# EAGLE board snc98_Display_15x7-Segment_LED (EAGLE 6.6.0)
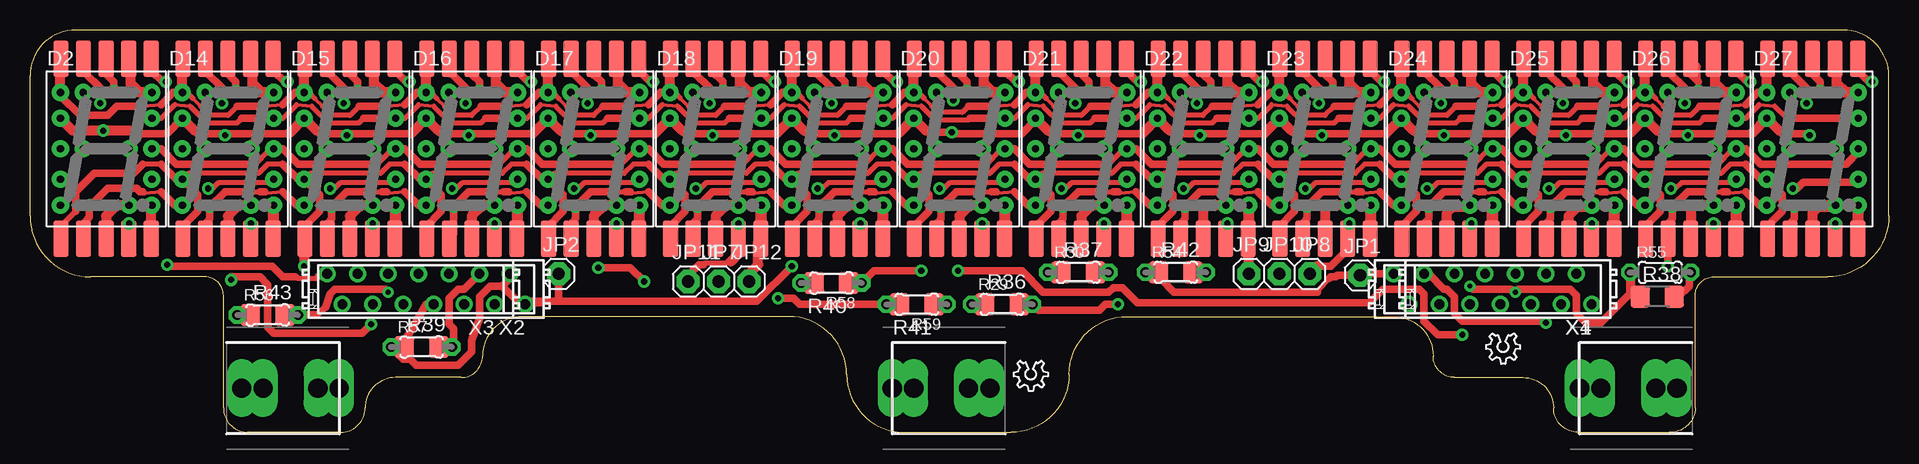
[diagram p2: board, top side]
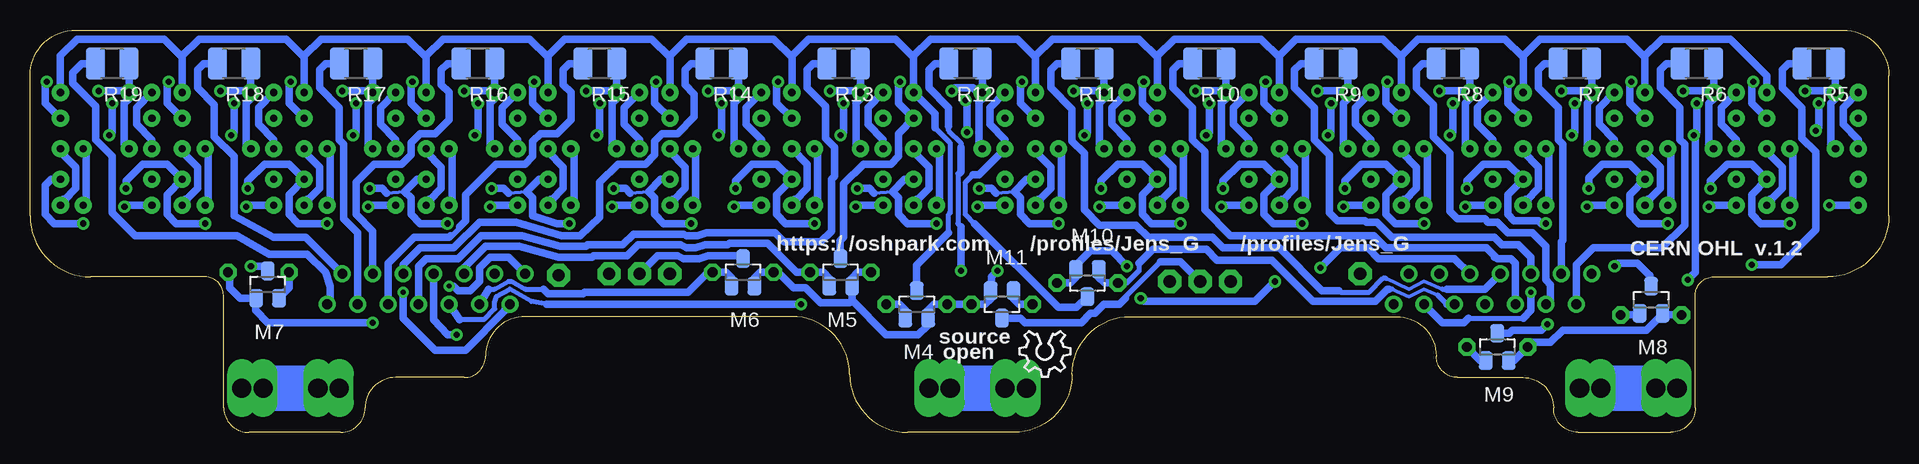
[diagram p3: board, bottom side, seen from below]

Size 154.94 x 33.53 mm. Coordinates in mm from the lower left corner, seen from the top.
Outline: 154.94,29.72 arc90 151.13,33.53 3.81,33.53 arc90 0,29.72 0,18.03 arc90 5.08,12.95 14.61,12.95 arc-90 16.13,11.43 16.13,2.03 arc90 18.16,0 25.91,0 arc90 27.94,2.03 arc-90 30.48,4.57 35.94,4.57 arc90 37.72,6.35 arc-90 41.02,9.65 63.25,9.65 arc-90 68.07,4.83 arc90 72.9,0 81.79,0 arc90 86.61,4.83 arc-90 91.44,9.65 113.67,9.65 arc-90 116.97,6.35 arc90 118.75,4.57 124.46,4.57 arc-90 127,2.03 arc90 129.03,0 136.65,0 arc90 138.81,2.03 138.81,11.43 arc-90 140.34,12.95 149.86,12.95 arc90 154.94,18.03 154.94,29.72
Copper layers (1*16): Top 0.035mm / dielectric 1.5mm / Bottom 0.035mm
Design rules "OSHPark-8mil-2layer": minimum track width 10mil, minimum drill 15mil, track to track 8mil, track to pad 8mil, pad to pad 8mil, via to via 8mil, smd to smd 8mil, copper to edge 8mil, drill to drill 8mil, minimum pad ring 12mil, minimum via ring 10mil, stop-mask expansion 4mil, vias tented up to drill 20mil, thermal gap 10mil

## Footprints (pad centres in the part's own frame; a part is rotated, then mirrored left to right if it is on the bottom)
BATTERY-AAA-LEFT = drill 1.6 long: P1 -2.54,0; P2 3.81,0; P3 2.032,0; P4 -4.318,0
BATTERY-AAA-RIGHT = drill 1.6 long: M1 -3.81,0; M2 2.54,0; M3 4.318,0; M4 -2.032,0
10MM_UNI = drill 0.6 pad 1.422: 1 -3.81,4.699; 2 -3.81,2.54; 3 -3.81,0; 4 -3.81,-2.54; 5 -3.81,-4.699; 6 3.81,-4.699; 7 3.81,-2.54; 8 3.81,0; 9 3.81,2.54; 10 3.81,4.699; 11 -1.905,4.699; 12 -1.905,0; 13 1.905,0; 14 1.905,-4.699 | smd 1.27 x 3.048: 21 -3.76,-7.5; 22 -1.88,-7.5; 23 0,-7.5; 24 1.88,-7.5; 25 3.76,-7.5; 26 3.76,7.5; 27 1.88,7.5; 28 0,7.5; 29 -1.88,7.5; 30 -3.76,7.5
1X01 = drill 1.016 pad 1.93 octagon: 1 0,0
SOT-23 = smd 1.143 x 1.524: 1 0.953,1.143; 2 -0.953,1.143; 3 0,-1.143
R1210 = smd 1.6 x 2.7: 1 -1.4,0; 2 1.4,0
0204/5 = drill 0.813 octagon: 1 -2.54,0; 2 2.54,0
R1206 = smd 1.6 x 1.803: 1 -1.422,0; 2 1.422,0
MICROMATCH-12 = drill 0.813: 1 6.985,-1.27; 2 5.715,1.27; 3 4.445,-1.27; 4 3.175,1.27; 5 1.905,-1.27; 6 0.635,1.27; 7 -0.635,-1.27; 8 -1.905,1.27; 9 -3.175,-1.27; 10 -4.445,1.27; 11 -5.715,-1.27; 12 -6.985,1.27
MICROMATCH-14 = drill 0.813: 1 8.255,-1.27; 2 6.985,1.27; 3 5.715,-1.27; 4 4.445,1.27; 5 3.175,-1.27; 6 1.905,1.27; 7 0.635,-1.27; 8 -0.635,1.27; 9 -1.905,-1.27; 10 -3.175,1.27; 11 -4.445,-1.27; 12 -5.715,1.27; 13 -6.985,-1.27; 14 -8.255,1.27

## Placement (x,y rotation side)
BH4  HOLDER_AAA_LEFT1  [BATTERY-AAA-LEFT]  133.48,3.68 0 top
BH5  HOLDER_AAA_LEFT1  [BATTERY-AAA-LEFT]  76.2,3.68 0 top
BH6  HOLDER_AAA_RIGHT  [BATTERY-AAA-RIGHT]  21.46,3.68 0 top
D2  SC40-11_UNISC40-11_UNI  [10MM_UNI]  6.35,23.62 0 top
D14  SC40-11_UNISC40-11_UNI  [10MM_UNI]  16.51,23.62 0 top
D15  SC40-11_UNISC40-11_UNI  [10MM_UNI]  26.67,23.62 0 top
D16  SC40-11_UNISC40-11_UNI  [10MM_UNI]  36.83,23.62 0 top
D17  SC40-11_UNISC40-11_UNI  [10MM_UNI]  46.99,23.62 0 top
D18  SC40-11_UNISC40-11_UNI  [10MM_UNI]  57.15,23.62 0 top
D19  SC40-11_UNISC40-11_UNI  [10MM_UNI]  67.31,23.62 0 top
D20  SC40-11_UNISC40-11_UNI  [10MM_UNI]  77.47,23.62 0 top
D21  SC40-11_UNISC40-11_UNI  [10MM_UNI]  87.63,23.62 0 top
D22  SC40-11_UNISC40-11_UNI  [10MM_UNI]  97.79,23.62 0 top
D23  SC40-11_UNISC40-11_UNI  [10MM_UNI]  107.95,23.62 0 top
D24  SC40-11_UNISC40-11_UNI  [10MM_UNI]  118.11,23.62 0 top
D25  SC40-11_UNISC40-11_UNI  [10MM_UNI]  128.27,23.62 0 top
D26  SC40-11_UNISC40-11_UNI  [10MM_UNI]  138.43,23.62 0 top
D27  SC40-11_UNISC40-11_UNI  [10MM_UNI]  148.59,23.62 0 top
JP1  [1X01]  110.87,13.08 0 top
JP2  [1X01]  44.07,13.21 0 top
JP7  [1X01]  57.4,12.57 0 top
JP8  [1X01]  106.68,13.21 0 top
JP9  [1X01]  101.6,13.21 0 top
JP10  [1X01]  104.14,13.21 0 top
JP11  [1X01]  54.86,12.57 0 top
JP12  [1X01]  59.94,12.57 0 top
LOGO1  OSHW_LOGO_8MILX0150-NT  [OSHW_8X150_NOTEXT]  68.22,8.43 180 bottom
LOGO2  OSHW_LOGO_6MILX0100-NT  [OSHW_6X100_NOTEXT]  84.84,5.97 180 top
LOGO3  OSHW_LOGO_6MILX0100-NT  [OSHW_6X100_NOTEXT]  124.21,8.26 180 top
M4  IRLML2244  [SOT-23]  81.03,10.67 180 bottom
M5  IRLML2244  [SOT-23]  87.38,13.34 180 bottom
M6  IRLML2244  [SOT-23]  95.5,13.34 180 bottom
M7  IRLML2244  [SOT-23]  135.13,12.32 180 bottom
M8  IRLML2244  [SOT-23]  19.81,11.05 180 bottom
M9  IRLML2244  [SOT-23]  32.64,7.11 180 bottom
M10  IRLML2244  [SOT-23]  66.8,12.45 0 bottom
M11  IRLML2244  [SOT-23]  73.91,10.67 0 bottom
R5  22  [R1210]  5.84,30.73 180 bottom
R6  22  [R1210]  16,30.73 180 bottom
R7  22  [R1210]  26.16,30.73 180 bottom
R8  22  [R1210]  36.32,30.73 180 bottom
R9  22  [R1210]  46.48,30.73 180 bottom
R10  22  [R1210]  56.64,30.73 180 bottom
R11  22  [R1210]  66.8,30.73 180 bottom
R12  22  [R1210]  76.96,30.73 180 bottom
R13  22  [R1210]  87.12,30.73 180 bottom
R14  22  [R1210]  97.28,30.73 180 bottom
R15  22  [R1210]  107.44,30.73 180 bottom
R16  22  [R1210]  117.6,30.73 180 bottom
R17  22  [R1210]  127.76,30.73 180 bottom
R18  22  [R1210]  137.92,30.73 180 bottom
R19  22  [R1210]  148.08,30.73 180 bottom
R29  3k3  [0204/5]  81.03,10.67 0 top
R30  3k3  [0204/5]  87.38,13.34 0 top
R36  3k3  [R1206]  81.03,10.67 0 top
R37  3k3  [R1206]  87.38,13.34 0 top
R38  3k3  [R1206]  135.64,11.3 0 top
R39  3k3  [R1206]  32.64,7.11 0 top
R40  3k3  [R1206]  66.8,12.45 180 top
R41  3k3  [R1206]  73.91,10.67 180 top
R42  3k3  [R1206]  95.5,13.34 0 top
R43  3k3  [R1206]  19.81,9.78 0 top
R54  3k3  [0204/5]  95.5,13.34 0 top
R55  3k3  [0204/5]  135.89,13.34 0 top
R56  3k3  [0204/5]  19.81,9.78 0 top
R57  3k3  [0204/5]  32.64,7.11 0 top
R58  3k3  [0204/5]  66.8,12.45 180 top
R59  3k3  [0204/5]  73.91,10.67 180 top
X1  MICROMATCH-12  [MICROMATCH-12]  123.19,11.94 180 top
X2  MICROMATCH-14  [MICROMATCH-14]  33.02,11.94 180 top
X3  MICROMATCH-12  [MICROMATCH-12]  31.75,11.94 180 top
X4  MICROMATCH-14  [MICROMATCH-14]  121.92,11.94 180 top

## Tracks (layer width: path | path; a pad name or v marks a point on that pad's centre or on a via)
CA_LED  (via drill 0.41, 0.51)
  Top 0.254: 31.92,8.79 31.75,8.89 31.75,7.62 R39.1
  Top 0.406: 36.2,6.22 36.2,6.1 | 108.33,12.83 107.31,11.81 107.31,11.68
  Top 0.61: R43.1 R56.1 | 43.81,10.92 60.58,10.92 v63.5,13.84 | 43.81,10.92 42.67,10.92 | 42.67,10.92 40.64,10.92 39.37,12.19 | R36.1 R29.1 | R37.1 85.95,13.36 85.85,13.46 84.96,13.46 R30.1 | R54.1 93.7,13.31 R42.1 94.25,13.17 94.25,12.79 95.36,11.68 107.31,11.68 | X2.8 33.02,10.67 31.92,8.79 31.24,7.62 31.24,7.14 | 39.37,12.19 38.35,12.19 37.47,11.3 37.47,9.53 36.83,7.62 36.83,6.73 36.2,6.1 35.69,5.59 32.21,5.59 31.7,6.1 31.11,6.1 R57.1 R39.1 | X4.1 110.24,13.21 JP1.1 108.97,13.08 108.84,12.95 108.46,12.95 108.33,12.83 | X2.13 40.01,12.83 39.37,12.19 | X2.14 42.55,10.79 42.67,10.92 | JP2.1 44.07,11.18 43.81,10.92 | R58.1 R40.1 | R58.1 68.76,12.45 | 31.7,6.63 R39.1 | 31.11,7.21 R39.1 | R41.1 R59.1 | v74.3,13.46 70.36,13.46 R58.1 | R38.1 134.21,11.33 133.48,12.06 133.48,13.21 R55.1 133.35,11.56 130.94,9.14 129.67,9.14 128.91,9.91 128.91,11.43 128.4,11.94 124.08,11.94 v123.83,11.68 123.7,11.68 123.44,11.94 120.27,11.94 v120.02,12.19
  Bottom 0.61: v63.5,13.84 64.77,15.11 66.55,15.11 67.74,13.92 M10.2 67.74,12.93 R40.1 R58.1 68.33,12.45 | R56.1 18.75,9.78 M8.2 19,9.7 20.19,8.51 27.18,8.51 28.19,7.49 29.72,7.49 R57.1 31.24,5.97 M9.2 | R30.1 R37.1 86.44,12.85 M5.2 86.44,12.31 86.44,11 | 86.44,11 83.57,8.13 80.9,8.13 80.14,8.89 80.14,9.6 M4.2 80.09,10.19 R36.1 R29.1 R59.1 R41.1 74.85,11.15 M11.2 74.8,11.73 74.8,12.95 v74.3,13.46 | 86.44,11 86.64,10.79 89.03,10.79 90.3,12.06 91.31,12.06 92.58,13.34 R54.1 R42.1 94.55,12.87 M6.2 | v120.02,12.19 119.63,12.19 119.25,11.81 118.24,11.81 117.47,12.57 117.47,13.72 116.59,14.61 115.06,14.61 X4.1 | v123.83,11.68 123.83,9.53 121.16,6.86 118.62,6.86 115.32,10.16 115.32,10.29 X4.2 | M7.2 R38.1 134.21,11.33 133.6,11.81 | 133.6,11.81 133.35,12.06 R55.1 | 133.6,11.81 134.11,11.3 134.24,11.3
D0_A  (via drill 0.51)
  Top 0.406: 22.1,12.95 22.23,12.95 22.35,12.83 23.88,12.83 24,12.95
  Top 0.61: v11.43,13.97 11.56,13.84 20.19,13.84 21.08,12.95 22.1,12.95 | X2.1 24.26,13.21 24,12.95
  Bottom 0.61: v11.43,13.97 9.02,13.97 6.1,16.89 6.1,23.37 7.24,24.51 7.24,27.05 8.89,28.7 8.89,30.23 8.38,30.73 R5.2
D1_A
  Bottom 0.61: R6.2 18.54,30.73 19.05,30.23 19.05,28.7 17.4,27.05 17.4,24.38 17.02,24 17.02,17.27 18.92,15.37 24.64,15.37 26.04,13.97 X2.2
D2_A
  Bottom 0.61: X3.3 27.3,15.88 27.18,16 27.18,24 27.56,24.38 27.56,27.05 29.21,28.7 29.21,30.23 28.7,30.73 R7.2
D3_A
  Bottom 0.61: R8.2 38.86,30.73 39.37,30.23 39.37,28.7 37.97,27.3 37.97,24.64 36.58,23.24 36.58,18.41 35.94,17.78 33.66,17.78 33.4,17.53 32.64,17.53 31.75,16.64 29.72,16.64 28.57,15.49 28.57,12.7 28.19,12.32 28.19,11.05 X3.4
D4_A
  Bottom 0.61: R9.2 49.02,30.73 49.53,30.23 49.53,28.7 47.88,27.05 47.88,24.38 46.61,23.11 46.61,18.29 45.97,17.65 43.69,17.65 43.56,17.53 42.67,17.53 41.4,16.26 32.89,16.26 32.26,15.62 30.86,15.62 29.84,14.61 X3.5
D5_A
  Bottom 0.61: R10.2 59.18,30.73 59.69,30.23 59.69,28.7 58.04,27.05 58.04,24.38 57.02,23.37 57.02,18.54 54.86,16.38 42.93,16.38 41.91,15.37 33.53,15.37 32.77,14.61 | 32.89,14.61 32.77,14.61 | X3.6 31.11,14.1 31.5,14.48 32.64,14.48 32.77,14.61
D6_A
  Bottom 0.305: 37.21,11.94 38.73,12.57 40.01,11.94 41.91,12.83
  Bottom 0.406: 37.21,11.94 36.83,11.94 | 41.91,12.83 42.16,12.83 43.31,11.68 45.72,11.68 45.85,11.81
  Bottom 0.61: 45.85,11.81 47.24,11.81 50.8,15.37 55.5,15.37 56.39,16.26 61.72,16.26 62.74,17.27 65.79,17.27 67.06,18.54 67.06,23.24 68.07,24.26 68.07,26.92 69.85,28.7 69.85,30.23 69.34,30.73 R11.2 | X3.7 33.66,11.94 36.83,11.94
D7_A  (via drill 0.51)
  Top 0.61: v77.34,13.46 82.68,13.46 84.45,11.68 89.92,11.68 90.3,12.06 91.06,12.06 92.33,10.79 111.63,10.79 112.78,11.94 115.82,11.94 116.2,11.56 116.2,9.27 117.35,8.13 v119.38,8.13
  Bottom 0.406: 77.34,21.72 77.34,21.59 77.47,21.46 77.6,21.59 77.6,17.4 77.34,17.14 | 77.34,23.75 77.34,24.13 78.36,25.15 78.36,25.52
  Bottom 0.61: 77.34,17.14 v77.34,13.46 | R12.2 79.5,30.73 80.01,30.23 80.01,28.7 78.36,27.05 78.36,25.53 78.36,25.52 | 77.34,21.72 77.34,23.75 | X4.7 121.28,9.4 120.14,8.13 v119.38,8.13
D8_A
  Bottom 0.61: X4.8 122.56,13.84 121.92,14.48 119.25,14.48 117.35,16.38 113.92,16.38 110.74,15.49 108.58,15.49 108.46,15.62 105.54,15.62 104.65,16.51 100.46,16.51 100.2,16.38 99.31,16.38 98.55,16.64 92.84,16.64 92.08,15.88 89.03,15.88 88.14,16.76 88.14,21.08 87.88,21.34 87.88,23.75 88.65,24.51 88.65,27.18 90.17,28.7 90.17,30.23 89.66,30.73 R13.2
D9_A
  Bottom 0.61: X4.9 123.83,13.97 122.43,15.37 119.63,15.37 117.47,17.53 114.43,17.53 110.62,16.38 109.09,16.38 107.44,17.91 107.44,20.83 105.92,22.35 103.63,22.35 102.87,23.11 102.87,24.26 102.23,24.89 100.97,24.89 99.57,26.29 99.57,28.19 100.33,28.96 100.33,30.23 99.82,30.73 R14.2
D10_A
  Bottom 0.406: 119.89,16.38 119.76,16.38 119.13,17.02 119.13,17.14
  Bottom 0.61: 119.89,16.38 120.02,16.26 122.94,16.26 125.09,14.1 X4.10 | 119.13,17.14 118.62,17.65 118.62,19.81 116.08,22.35 113.67,22.35 113.03,22.99 113.03,24.26 112.39,24.89 111,24.89 109.86,26.04 109.86,28.32 110.49,28.96 110.49,30.23 109.98,30.73 R15.2
D11_A
  Bottom 0.61: R16.2 120.14,30.73 120.65,30.23 120.65,28.96 120.02,28.32 120.02,26.04 121.16,24.89 122.43,24.89 123.19,24.13 123.19,23.11 123.95,22.35 126.24,22.35 127.76,20.83 127.76,18.16 126.36,16.76 X1.9
D12_A
  Bottom 0.61: 129.29,30.61 R17.2 130.3,30.73 130.81,30.23 130.81,28.7 129.16,27.05 129.16,24.38 128.78,24 128.78,17.78 127.64,16.64 X4.12
D13_A
  Bottom 0.61: X4.13 131.95,16.26 134.62,16.26 137.92,18.03 137.92,22.99 139.57,24.64 139.57,27.3 140.97,28.7 140.97,30.23 140.46,30.73 R18.2
D14_A
  Bottom 0.61: 149.73,30.48 R19.2 150.62,30.73 151.38,29.97 151.38,29.08 149.48,27.18 149.48,24.38 148.08,22.99 148.08,18.29 146.18,16.38 137.67,16.38 135,14.86 131.83,14.86 130.3,13.34 129.92,12.19 129.92,10.92 X4.14
DIG_0  (via drill 0.51)
  Top 0.61: D2.28 6.35,29.84 6.99,29.21 v6.99,28.45
  Top 0.813: D2.14 7.24,18.92 6.35,18.03 D2.23 | D2.13 D2.12
  Bottom 0.61: D2.12 4.83,24 4.83,27.43 4.45,27.81 D2.11 4.45,30.48 4.44,30.48 R5.1 | v6.99,28.45 4.7,28.45 4.45,28.7 | 8.26,23.5 8,23.24 8,19.18 D2.14
  Bottom 0.813: D2.11 4.45,28.7 | D2.13 8.26,23.5
DIG_1  (via drill 0.51)
  Top 0.406: 16.13,29.84 16.51,29.84 D14.28
  Top 0.61: 16.51,29.84 17.14,29.21 v17.14,28.45
  Top 0.813: D14.23 16.51,18.03 17.4,18.92 D14.14 | D14.13 D14.12
  Bottom 0.305: R6.1 14.6,30.48 14.61,30.48
  Bottom 0.61: D14.12 14.99,24 14.99,27.43 14.61,27.81 D14.11 14.61,30.48 | 14.61,28.7 14.86,28.45 v17.14,28.45 | 18.41,23.5 18.16,23.24 18.16,19.18 D14.14
  Bottom 0.813: D14.11 14.61,28.7 | D14.13 18.41,23.5
DIG_2  (via drill 0.51)
  Top 0.61: v27.3,28.45 27.3,29.21 26.67,29.84 D15.28
  Top 0.813: D15.13 D15.12 | D15.23 26.67,18.03 27.56,18.92 D15.14
  Bottom 0.305: R7.1 24.76,30.48 24.77,30.48
  Bottom 0.61: D15.12 25.15,24 25.15,27.43 24.77,27.81 D15.11 24.77,30.48 | 24.77,28.7 25.02,28.45 v27.3,28.45 | 28.57,23.5 28.32,23.24 28.32,19.18 D15.14
  Bottom 0.813: D15.11 24.77,28.7 | D15.13 28.57,23.5
DIG_3  (via drill 0.51)
  Top 0.61: v37.47,28.45 37.47,29.21 36.83,29.84 D16.28
  Top 0.813: D16.13 D16.12 | D16.23 36.83,18.03 37.72,18.92 D16.14
  Bottom 0.61: 38.73,23.5 38.48,23.24 38.48,19.18 D16.14 | D16.12 35.31,24 35.31,27.43 34.92,27.81 D16.11 R8.1 | 34.92,28.7 35.18,28.45 v37.47,28.45
  Bottom 0.813: D16.13 38.73,23.5 | D16.11 34.92,28.7
DIG_4  (via drill 0.51)
  Top 0.61: 46.99,29.84 47.62,29.21 v47.62,28.45
  Top 0.813: D17.23 46.99,18.03 47.88,18.92 D17.14 | D17.13 D17.12 | 46.99,29.84 D17.28
  Bottom 0.61: D17.12 45.47,24 45.47,27.43 45.09,27.81 D17.11 45.09,30.48 | 45.09,28.7 45.34,28.45 v47.62,28.45 | 48.9,23.5 48.64,23.24 48.64,19.18 D17.14
  Bottom 0.813: D17.11 45.09,28.7 | D17.13 48.9,23.5 | 45.09,30.48 R9.1
DIG_5  (via drill 0.51)
  Top 0.61: 57.15,29.84 57.78,29.21 v57.78,28.45
  Top 0.813: D18.12 D18.13 | D18.23 57.15,18.03 58.04,18.92 D18.14 | D18.28 57.15,29.84
  Bottom 0.61: 59.05,23.5 58.8,23.24 58.8,19.18 D18.14 | D18.12 55.63,24 55.63,27.43 55.24,27.81 D18.11 55.24,30.48 | 55.24,28.7 55.5,28.45 v57.78,28.45
  Bottom 0.813: D18.13 59.05,23.5 | D18.11 55.24,28.7 | 55.24,30.48 R10.1
DIG_6  (via drill 0.51)
  Top 0.61: v67.94,28.45 67.94,29.21 67.31,29.84 D19.28
  Top 0.813: D19.13 D19.12 | D19.23 67.31,18.03 68.2,18.92 D19.14
  Bottom 0.61: D19.12 65.79,24 65.79,27.43 65.41,27.81 D19.11 R11.1 | v67.94,28.45 65.66,28.45 65.41,28.7 | 69.22,23.5 68.96,23.24 68.96,19.18 D19.14
  Bottom 0.813: D19.11 65.41,28.7 | D19.13 69.22,23.5
DIG_7  (via drill 0.51)
  Top 0.61: v78.11,28.45 78.11,29.21 77.47,29.84 D20.28
  Top 0.813: D20.13 D20.12 | D20.23 77.47,18.03 78.36,18.92 D20.14
  Bottom 0.61: D20.12 75.82,23.88 75.82,27.56 75.56,27.81 D20.11 R12.1 | 75.56,28.7 75.82,28.45 76.07,28.45 76.33,28.7 77.85,28.7 v78.11,28.45 | 79.38,23.5 79.12,23.24 79.12,19.18 D20.14
  Bottom 0.813: D20.11 75.56,28.7 | D20.13 79.38,23.5
DIG_8  (via drill 0.51)
  Top 0.61: v88.27,28.45 88.27,29.21 87.63,29.84 D21.28
  Top 0.813: D21.13 D21.12 | D21.23 87.63,18.03 88.52,18.92 D21.14
  Bottom 0.61: D21.12 86.11,24 86.11,27.43 85.72,27.81 D21.11 R13.1 | v88.27,28.45 85.98,28.45 85.72,28.7 | 89.53,23.5 89.28,23.24 89.28,19.18 D21.14
  Bottom 0.813: D21.11 85.72,28.7 | D21.13 89.53,23.5
DIG_9  (via drill 0.51)
  Top 0.61: v98.42,28.45 98.42,29.21 97.79,29.84 D22.28
  Top 0.813: D22.23 97.79,18.54 98.17,18.92 D22.14 98.68,18.92 | D22.13 D22.12
  Bottom 0.61: D22.12 96.27,24 96.27,27.43 95.89,27.81 D22.11 95.89,30.48 | v98.42,28.45 96.14,28.45 95.89,28.7 | 99.69,23.5 99.44,23.24 99.44,19.18 D22.14
  Bottom 0.813: D22.11 95.89,28.7 | 95.89,30.48 R14.1 | D22.13 99.69,23.5
DIG_10  (via drill 0.51)
  Top 0.61: v108.58,28.45 108.58,29.21 107.95,29.84 D23.28
  Top 0.813: D23.13 D23.12 | D23.23 107.95,18.54 108.33,18.92 D23.14 108.84,18.92
  Bottom 0.61: 109.86,23.5 109.6,23.24 109.6,19.18 D23.14 | D23.12 106.43,24 106.43,27.43 106.05,27.81 D23.11 R15.1 | v108.58,28.45 106.3,28.45 106.05,28.7
  Bottom 0.813: D23.13 109.86,23.5 | D23.11 106.05,28.7
DIG_11  (via drill 0.51)
  Top 0.61: v118.75,28.45 118.75,29.21 118.11,29.84 D24.28
  Top 0.813: D24.13 D24.12 | D24.23 118.11,18.29 118.62,18.8 119.89,18.8 D24.14
  Bottom 0.61: D24.12 116.59,24 116.59,27.43 116.2,27.81 D24.11 R16.1 | 116.2,28.7 116.46,28.45 v118.75,28.45 | 120.02,23.5 119.76,23.24 119.76,19.18 D24.14
  Bottom 0.813: D24.11 116.2,28.7 | D24.13 120.02,23.5
DIG_12  (via drill 0.51)
  Top 0.406: 128.27,29.84 D25.28
  Top 0.61: 128.27,29.84 128.91,29.21 v128.91,28.45
  Top 0.813: D25.13 D25.12 | D25.23 128.27,18.03 129.03,18.8 130.05,18.8 D25.14
  Bottom 0.61: 130.18,23.5 129.92,23.24 129.92,19.18 D25.14 | D25.12 126.75,24 126.75,27.43 126.36,27.81 D25.11 R17.1 | v128.91,28.45 126.62,28.45 126.36,28.7
  Bottom 0.813: D25.13 130.18,23.5 | D25.11 126.36,28.7
DIG_13  (via drill 0.51)
  Top 0.406: v139.06,28.45 139.06,30.49 D26.28
  Top 0.61: 139.06,29.21 138.43,29.84 D26.28
  Top 0.813: D26.13 D26.12 | D26.14 138.81,18.92 138.43,18.54 D26.23
  Bottom 0.61: D26.12 136.91,24 136.91,27.43 136.53,27.81 D26.11 R18.1 | v139.06,28.45 136.78,28.45 136.53,28.7 | 140.34,23.5 140.08,23.24 140.08,19.18 D26.14
  Bottom 0.813: D26.11 136.53,28.7 | D26.13 140.34,23.5
DIG_14  (via drill 0.51)
  Top 0.61: v149.22,28.45 149.22,29.21 148.59,29.84 D27.28
  Top 0.813: D27.13 D27.12 | D27.23 148.59,18.29 149.1,18.8 150.37,18.8 D27.14 149.48,18.92
  Bottom 0.61: D27.12 147.07,24 147.07,27.43 146.69,27.81 D27.11 R19.1 | v149.22,28.45 146.94,28.45 146.69,28.7 | 150.5,23.5 150.24,23.24 150.24,19.18 D27.14
  Bottom 0.813: D27.11 146.69,28.7 | D27.13 150.5,23.5
IO-A  (via drill 0.51)
  Top 0.61: R36.2 R29.2 84.07,10.16 89.15,10.16 89.66,10.67 v90.68,10.67
  Bottom 0.406: 111.89,10.67 113.16,10.92 114.94,11.94 116.08,11.3 116.2,10.92 116.2,10.29 117.09,9.4 119.13,9.4
  Bottom 0.61: M4.1 81.97,10.19 R36.2 R29.2 | v90.68,10.67 111.89,10.67 | 119.13,9.4 X4.6
IO-B
  Top 0.61: R37.2 R30.2
  Bottom 0.61: M5.1 88.32,12.85 R37.2 R30.2 91.06,13.34 93.47,15.75 96.65,15.75 96.77,15.62 98.68,15.62 99.44,15.37 100.2,15.37 100.71,15.62 104.27,15.62 105.16,14.73 107.95,14.73 108.08,14.61 110.87,14.61 114.17,15.49 116.97,15.49 118.75,13.72 X4.5
IO-C
  Top 0.61: R42.2 97.56,13.31 R54.2
  Bottom 0.406: 116.71,11.94 116.2,11.94 115.06,12.57 114.81,12.57 113.67,11.94 112.14,11.94
  Bottom 0.61: 112.14,11.94 111.76,11.56 108.84,11.56 108.71,11.68 100.08,11.68 98.57,13.19 98.06,13.31 98.15,13.31 R54.2 R42.2 96.46,12.87 M6.1 | 116.71,11.94 X4.4
IO-D  (via drill 0.51 pad 0.25)
  Top 0.61: X4.3 116.59,13.21 117.86,11.94 118.11,11.94 118.75,11.3 118.75,9.91 119.38,9.27 126.24,9.27 v126.36,9.14 | R38.2 137.41,11.3 138.3,12.19 138.3,13.21 R55.2
  Bottom 0.61: v126.36,9.14 135.13,9.14 136.14,10.16 136.14,11.1 136.19,11.3 M7.1 137.41,11.18 138.3,12.06 138.3,13.21 R55.2
IO-DP  (via drill 0.51, 0.51 pad 0.25)
  Top 0.61: R41.2 R59.2 64.14,10.67 63.63,11.18 v62.36,11.18 | v47.37,13.72 50.04,13.72 v51.18,12.57
  Bottom 0.61: 71.83,10.67 R59.2 R41.2 72.96,11.14 M11.1 | v62.36,11.18 62.1,10.92 52.83,10.92 v51.18,12.57 | X3.9 36.2,14.48 42.55,14.48 43.43,15.37 45.72,15.37 v47.37,13.72
IO-E  (via drill 0.4)
  Top 0.406: 24.89,11.3 25.02,11.56
  Top 0.61: R43.2 R56.2 23.88,9.78 24.64,10.41 25.02,11.56 25.4,11.94 29.59,11.94 v29.84,11.68
  Bottom 0.406: 35.05,9.53 30.48,9.53
  Bottom 0.61: R56.2 20.88,9.78 M8.1 | v29.84,11.68 29.84,10.16 30.48,9.53 | X2.12 37.21,9.14 35.43,9.14 35.05,9.53
IO-F
  Top 0.61: R39.2 R57.2 35.31,7.24 35.31,8.64 34.92,9.02 34.92,11.18 35.69,11.94 36.2,11.94 X2.11
  Bottom 0.61: M9.1 34.04,5.97 R57.2
IO-G
  Top 0.61: R40.2 R58.2
  Bottom 0.305: 37.59,11.43 38.73,11.94 40.01,11.3 41.4,11.94
  Bottom 0.406: R58.2 63.5,12.45 62.48,13.46 62.48,14.1 | 36.83,10.67 37.59,11.43 | 41.4,11.94 41.66,11.94
  Bottom 0.61: 62.48,14.1 61.34,15.24 56.9,15.24 56.01,14.35 51.44,14.35 48.01,10.92 42.8,10.92 41.78,11.94 41.66,11.94 | M10.1 65.86,12.93 R40.2 R58.2 | X2.10 36.83,10.67
NC1
  Bottom 2.184: BH4.P1 BH4.P4 | BH4.P3 BH4.P2
  Bottom 3.81: BH4.P1 BH4.P3
NC2
  Bottom 2.184: BH5.P1 BH5.P4 | BH5.P3 BH5.P2
  Bottom 3.81: BH5.P1 BH5.P3
NC3
  Bottom 2.184: BH6.M1 BH6.M4 | BH6.M2 BH6.M3
  Bottom 3.81: BH6.M4 BH6.M2
SEG_A
  Top 0.61: 49.02,30.97 D17.27 | 59.18,30.97 D18.27 | 69.34,30.97 D19.27 | 130.3,30.97 D25.27 | 140.46,30.97 D26.27 | D27.27 150.62,30.97 | 109.98,30.97 D23.27 | 99.82,30.97 D22.27 | D16.27 38.86,30.97 | D24.27 120.14,30.97
  Top 0.813: D2.10 9.14,28.32 8.38,29.08 8.38,30.97 D2.27 | 18.54,29.08 19.3,28.32 D14.10 19.05,28.32 18.54,28.83 18.54,30.97 D14.27 | 150.62,29.08 151.38,28.32 D27.10 151.13,28.32 150.62,28.83 150.62,30.97 | 49.02,30.97 49.02,28.83 49.53,28.32 D17.10 49.78,28.32 49.02,29.08 | 29.46,28.32 29.21,28.32 28.7,28.83 28.7,30.97 D15.27 | 29.46,28.32 28.7,29.08 | D15.10 29.46,28.32 | 130.3,29.08 131.06,28.32 D25.10 130.81,28.32 130.3,28.83 130.3,30.97 | 140.46,29.08 141.22,28.32 D26.10 140.97,28.32 140.46,28.83 140.46,30.97 | 120.14,29.08 120.9,28.32 D24.10 120.65,28.32 120.14,28.83 120.14,30.97 | 99.82,29.08 100.58,28.32 D22.10 100.33,28.32 99.82,28.83 99.82,30.97 | 109.98,29.08 110.74,28.32 D23.10 110.49,28.32 109.98,28.83 109.98,30.97 | 79.5,29.08 80.26,28.32 D20.10 80.01,28.32 79.5,28.83 79.5,30.97 D20.27 | 89.66,29.08 90.42,28.32 D21.10 90.17,28.32 89.66,28.83 89.66,30.97 D21.27 | 59.18,29.08 59.94,28.32 D18.10 59.69,28.32 59.18,28.83 59.18,30.97 | 69.34,29.08 70.1,28.32 D19.10 69.85,28.32 69.34,28.83 69.34,30.97 | 38.86,29.08 39.62,28.32 D16.10 39.37,28.32 38.86,28.83 38.86,30.97
  Bottom 0.406: 78.36,16.64 78.36,18.16 78.23,18.29 78.23,24.13 79.5,25.4
  Bottom 0.61: D2.10 10.16,29.72 13.21,32.77 18.92,32.77 20.32,31.37 20.32,31.24 | D14.10 20.32,31.24 | 20.32,31.24 21.84,32.77 29.08,32.77 30.48,31.37 30.48,31.24 | D27.10 152.4,31.37 151,32.77 143.76,32.77 142.24,31.24 | 142.24,31.24 142.24,31.37 140.84,32.77 133.6,32.77 132.08,31.24 | D26.10 142.24,31.24 | 121.92,31.24 121.92,31.37 120.52,32.77 113.28,32.77 111.76,31.24 | D24.10 121.92,31.24 | 121.92,31.24 123.44,32.77 130.68,32.77 132.08,31.37 132.08,31.24 | 111.76,31.24 111.76,31.37 110.36,32.77 103.12,32.77 101.6,31.24 | D23.10 111.76,31.24 | 101.6,31.24 101.6,31.37 100.2,32.77 92.96,32.77 91.44,31.24 | D22.10 101.6,31.24 | 91.44,31.24 91.44,31.37 90.04,32.77 82.8,32.77 81.28,31.24 | D21.10 91.44,31.24 | 71.12,31.24 71.12,31.37 69.72,32.77 62.48,32.77 60.96,31.24 | D19.10 71.12,31.24 | 71.12,31.24 72.64,32.77 79.88,32.77 81.28,31.37 81.28,31.24 | 60.96,31.24 60.96,31.37 59.56,32.77 52.32,32.77 50.8,31.24 | D18.10 60.96,31.24 | 50.8,31.24 50.8,31.37 49.4,32.77 42.16,32.77 40.64,31.24 | D17.10 50.8,31.24 | 40.64,31.24 40.64,31.37 39.24,32.77 32,32.77 30.48,31.24 | D16.10 40.64,31.24 | D15.10 30.48,31.24 | D25.10 132.08,31.24 | 81.28,31.24 D20.10 79.5,26.54 79.5,25.4 | 78.36,16.64 81.05,13.95 81.05,11.71 M4.3
SEG_B  (via drill 0.51)
  Top 0.305: 12.06,27.3 13.34,27.18 | 22.23,27.3 23.5,27.18 | 144.15,27.3 145.41,27.18 | 133.99,27.3 135.25,27.18 | 32.38,27.3 33.66,27.18 | 42.55,27.3 43.81,27.18 | 103.5,27.3 104.78,27.18 | 93.34,27.3 94.61,27.18 | 62.87,27.3 64.14,27.18 | 52.7,27.3 53.98,27.18 | 113.67,27.3 114.94,27.18 | 73.03,27.3 74.3,27.18 | 83.19,27.3 84.45,27.18 | 123.83,27.3 125.09,27.18
  Top 0.406: D2.9 10.92,26.16 12.06,27.3 | 13.34,27.18 14.73,25.78 17.27,25.78 17.65,26.16 | 22.23,27.3 21.08,26.16 D14.9 | 23.5,27.18 24.89,25.78 27.43,25.78 27.81,26.16 | 144.15,27.3 143,26.16 D26.9 | 129.41,26.16 129.03,25.78 126.49,25.78 125.09,27.18 | 133.99,27.3 132.84,26.16 D25.9 | 135.25,27.18 136.65,25.78 139.19,25.78 139.57,26.16 | 32.38,27.3 31.24,26.16 D15.9 | 33.66,27.18 35.05,25.78 37.59,25.78 37.97,26.16 | 42.55,27.3 41.4,26.16 D16.9 | 43.81,27.18 45.21,25.78 47.75,25.78 48.13,26.16 | 98.93,26.16 98.55,25.78 96.01,25.78 94.61,27.18 | 103.5,27.3 102.36,26.16 D22.9 | 104.78,27.18 106.17,25.78 108.71,25.78 109.09,26.16 | 93.34,27.3 92.2,26.16 D21.9 | 58.29,26.16 57.91,25.78 55.37,25.78 53.98,27.18 | 62.87,27.3 61.72,26.16 D18.9 | 64.14,27.18 65.53,25.78 68.07,25.78 68.45,26.16 | 52.7,27.3 51.56,26.16 D17.9 | 113.67,27.3 112.52,26.16 D23.9 | 114.94,27.18 116.33,25.78 118.87,25.78 119.25,26.16 | D24.9 122.68,26.16 123.83,27.3 | 73.03,27.3 71.88,26.16 D19.9 | 74.3,27.18 75.44,26.04 78.23,26.04 78.36,26.16 | 83.19,27.3 82.04,26.16 D20.9 | 84.45,27.18 85.85,25.78 88.39,25.78 88.77,26.16 | 146.43,26.16 145.41,27.18 | 153.29,29.21 v153.54,29.21 | 152.4,31.07 152.4,30.48
  Top 0.61: v11.3,29.21 11.05,29.21 10.16,30.1 10.16,30.48 10.11,30.53 | 20.27,30.53 20.32,30.48 20.32,30.1 21.21,29.21 v21.46,29.21 | 17.65,26.16 D14.9 | 27.81,26.16 D15.9 | 153.29,29.21 152.4,30.1 152.4,30.48 | 129.41,26.16 D25.9 | v133.22,29.21 132.97,29.21 132.08,30.1 132.08,31.07 D25.26 | 139.57,26.16 D26.9 | v143.38,29.21 143.13,29.21 142.24,30.1 142.24,31.07 D26.26 | 37.97,26.16 D16.9 | v41.78,29.21 41.53,29.21 40.64,30.1 40.64,30.48 40.59,30.53 D16.26 | v31.62,29.21 31.37,29.21 30.48,30.1 30.48,30.48 30.43,30.53 | 98.93,26.16 D22.9 | v102.74,29.21 102.49,29.21 101.6,30.1 101.6,31.07 D22.26 | 109.09,26.16 D23.9 | 58.29,26.16 D18.9 | v62.1,29.21 61.85,29.21 60.96,30.1 60.96,30.48 60.91,30.53 D18.26 | 68.45,26.16 D19.9 | 48.13,26.16 D17.9 | 152.4,31.07 D27.26 | 119.25,26.16 D24.9 | v123.06,29.21 122.81,29.21 121.92,30.1 121.92,31.07 D24.26 | D23.26 111.76,31.07 111.76,30.1 112.65,29.21 v112.9,29.21 | D21.26 91.44,31.07 91.44,30.1 92.33,29.21 v92.58,29.21 | 78.36,26.16 D20.9 | v82.42,29.21 82.17,29.21 81.28,30.1 81.28,31.07 D20.26 | 88.77,26.16 D21.9 | D19.26 71.12,31.07 71.12,30.1 72.01,29.21 v72.26,29.21 | D17.26 50.8,31.07 50.8,30.1 51.69,29.21 v51.94,29.21 | D27.9 146.43,26.16
  Top 0.813: D2.26 10.11,30.53 | D14.26 20.27,30.53 | D15.26 30.43,30.53
  Bottom 0.406: 11.43,27.43 11.43,27.3
  Bottom 0.61: v11.3,29.21 11.43,29.08 11.43,27.43 D2.9 | v21.46,29.21 21.59,29.08 21.59,27.43 D14.9 | v82.42,29.21 82.55,29.08 82.55,27.43 D20.9 82.55,24.89 82.55,22.99 83.19,22.35 85.47,22.35 87.12,20.7 87.12,16.26 87.4,15.98 87.4,14.38 M5.3 | v92.58,29.21 92.71,29.08 92.71,27.43 D21.9 | v143.38,29.21 143.51,29.08 143.51,27.43 D26.9 | D27.9 153.67,27.43 153.67,29.08 v153.54,29.21 | v112.9,29.21 113.03,29.08 113.03,27.43 D23.9 | v133.22,29.21 133.35,29.08 133.35,27.43 D25.9 | v123.06,29.21 123.19,29.08 123.19,27.43 D24.9 | v102.74,29.21 102.87,29.08 102.87,27.43 D22.9 | v72.26,29.21 72.39,29.08 72.39,27.43 D19.9 | v62.1,29.21 62.23,29.08 62.23,27.43 D18.9 | v51.94,29.21 52.07,29.08 52.07,27.43 D17.9 | v41.78,29.21 41.91,29.08 41.91,27.43 D16.9 | v31.62,29.21 31.75,29.08 31.75,27.43 D15.9
SEG_C  (via drill 0.51)
  Top 0.406: v14.86,20.32 15.24,20.32 15.75,20.83 20.07,20.83 D14.7 | v25.02,20.32 25.4,20.32 25.91,20.83 30.23,20.83 D15.7 | v35.18,20.32 35.56,20.32 36.07,20.83 40.39,20.83 D16.7 | v45.34,20.32 45.72,20.32 46.23,20.83 50.55,20.83 D17.7 | v65.66,20.32 66.04,20.32 66.55,20.83 70.87,20.83 D19.7 | v75.82,20.32 76.2,20.32 76.71,20.83 81.03,20.83 D20.7 | v55.5,20.32 55.88,20.32 56.39,20.83 60.71,20.83 D18.7 | v116.46,20.32 116.84,20.32 117.35,20.83 121.67,20.83 D24.7 | v85.98,20.32 86.36,20.32 86.87,20.83 91.19,20.83 D21.7 | v126.62,20.32 127,20.32 127.51,20.83 131.83,20.83 D25.7 | v136.78,20.32 137.16,20.32 137.67,20.83 141.99,20.83 D26.7 | v96.14,20.32 96.52,20.32 97.03,20.83 101.35,20.83 D22.7 | v106.3,20.32 106.68,20.32 107.19,20.83 111.51,20.83 D23.7 | 58.42,14.22 58.17,14.22 58.04,14.1 56.26,14.1 56.13,13.97 | D27.24 150.47,17.37 v150.5,17.4 | D26.24 140.31,17.37 | 89.51,17.37 v89.53,17.4
  Top 0.61: D2.24 8.23,17.37 v8.26,17.4 | D14.24 18.39,17.37 v18.41,17.4 | D27.7 152.15,20.83 147.83,20.83 147.32,20.32 v146.94,20.32 | D17.24 48.87,17.37 v48.9,17.4 | v79.38,17.4 79.35,17.37 D20.24 | D18.24 59.03,17.37 v59.05,17.4 | D24.24 119.99,17.37 v120.14,17.4 | 140.31,17.37 v140.34,17.4 | D25.24 130.15,17.37 v130.18,17.4 | D23.24 109.83,17.37 v109.98,17.4 | D22.24 99.67,17.37 v99.82,17.4 | D15.24 28.55,17.37 v28.57,17.4 | D16.24 38.71,17.37 v38.73,17.4 | D19.24 69.19,17.37 v69.22,17.4 | D21.24 89.51,17.37 | 56.13,13.97 55.75,13.97 54.86,13.08 | 107.31,13.84 108.46,13.84 109.86,15.24
  Top 0.813: JP11.1 54.86,13.08 | 48.77,16.02 D17.24 | D18.24 59.03,14.83 58.42,14.22 | 109.86,15.24 109.86,16.1 D23.24 | 107.31,13.84 JP8.1
  Bottom 0.305: 72.9,20.07 74.42,19.94 | 83.06,20.07 84.58,19.94 | 123.7,20.07 125.22,19.94 | 113.54,20.07 115.06,19.94 | 103.38,20.07 104.9,19.94
  Bottom 0.61: v8.26,17.4 10.67,17.4 11.43,18.16 11.43,19.81 D2.7 11.43,22.35 13.46,22.35 14.86,20.95 v14.86,20.32 | v48.9,17.4 51.31,17.4 52.07,18.16 52.07,19.81 D17.7 52.07,22.35 54.1,22.35 55.5,20.95 v55.5,20.32 | D19.7 71.88,21.08 72.9,20.07 72.39,19.56 72.39,18.16 71.63,17.4 v69.22,17.4 | 74.42,19.94 74.8,20.32 v75.82,20.32 | D20.7 82.04,21.08 83.06,20.07 82.55,19.56 82.55,18.16 81.79,17.4 v79.38,17.4 | 84.58,19.94 84.96,20.32 v85.98,20.32 | D24.7 122.68,21.08 123.7,20.07 123.19,19.56 123.19,18.16 122.43,17.4 v120.14,17.4 | 125.22,19.94 125.6,20.32 v126.62,20.32 | D23.7 112.52,21.08 113.54,20.07 113.03,19.56 113.03,18.03 111,17.4 v109.98,17.4 | 115.06,19.94 115.44,20.32 v116.46,20.32 | v130.18,17.4 132.59,17.4 133.35,18.16 133.35,19.81 D25.7 133.35,22.35 135.38,22.35 136.78,20.95 v136.78,20.32 | v140.34,17.4 142.75,17.4 143.51,18.16 143.51,19.81 D26.7 143.51,22.35 145.54,22.35 146.94,20.95 v146.94,20.32 | v18.41,17.4 20.83,17.4 21.59,18.16 21.59,19.81 D14.7 21.59,22.35 23.88,22.35 25.02,21.21 v25.02,20.32 | v150.5,17.4 152.91,17.4 153.67,18.16 153.67,20.57 153.16,21.08 D27.7 | v59.05,17.4 61.47,17.4 62.23,18.16 62.23,19.81 D18.7 62.23,22.35 64.26,22.35 65.66,20.95 v65.66,20.32 | D22.7 102.36,21.08 103.38,20.07 102.87,19.56 102.87,18.16 102.11,17.4 v99.82,17.4 | v106.3,20.32 105.28,20.32 104.9,19.94 | v38.73,17.4 41.15,17.4 41.91,18.16 41.91,19.81 D16.7 41.91,22.35 43.94,22.35 45.34,20.95 v45.34,20.32 | v89.53,17.4 91.95,17.4 92.71,18.16 92.71,19.81 D21.7 92.71,22.35 94.74,22.35 96.14,20.95 v96.14,20.32 | v28.57,17.4 28.96,17.4 29.21,17.65 31.24,17.65 31.75,18.16 31.75,19.81 D15.7 31.75,22.35 33.78,22.35 35.18,20.95 v35.18,20.32
SEG_C_SOURCE
  Bottom 0.61: JP10.1 102.62,14.73 100.97,14.73 100.46,14.48 99.19,14.48 98.42,14.73 95.78,14.73 M6.3
SEG_D  (via drill 0.51)
  Top 0.305: 10.92,20.07 9.53,19.94 | 31.24,20.07 29.84,19.94 | 21.08,20.07 19.68,19.94 | 82.04,20.07 80.64,19.94 | 71.88,20.07 70.48,19.94 | 92.2,20.07 90.81,19.94 | 112.52,20.07 111.12,19.94 | 102.36,20.07 100.97,19.94 | 51.56,20.07 50.16,19.94 | 41.4,20.07 40.01,19.94 | 61.72,20.07 60.33,19.94 | 143,20.07 141.6,19.94 | 132.84,20.07 131.44,19.94 | 122.68,20.07 121.28,19.94
  Top 0.406: 9.53,19.94 9.4,20.07 | 29.84,19.94 29.72,20.07 | 27.81,20.07 29.34,20.07 | 17.65,20.07 19.18,20.07 | 19.68,19.94 19.56,20.07 | 80.64,19.94 80.52,20.07 | 78.61,20.07 80.14,20.07 | 68.45,20.07 69.98,20.07 | 70.48,19.94 70.36,20.07 | 90.81,19.94 90.68,20.07 | 88.77,20.07 90.3,20.07 | 111.12,19.94 111,20.07 | 109.09,20.07 110.62,20.07 | 100.97,19.94 100.84,20.07 | 50.16,19.94 50.04,20.07 | 48.13,20.07 49.66,20.07 | 37.97,20.07 39.5,20.07 | 40.01,19.94 39.88,20.07 | 60.33,19.94 60.2,20.07 | 58.29,20.07 59.82,20.07 | 141.6,19.94 141.48,20.07 | 139.57,20.07 141.1,20.07 | 129.41,20.07 130.94,20.07 | 131.44,19.94 131.32,20.07 | 121.28,19.94 121.16,20.07 | 119.25,20.07 120.78,20.07 | 98.93,20.07 100.46,20.07 | D20.22 75.59,16.15 75.69,16.26
  Top 0.61: D2.22 4.57,16.22 4.57,17.53 4.95,17.91 v4.95,18.92 5.08,18.92 6.48,20.32 8.89,20.32 9.14,20.07 9.4,20.07 | 10.92,20.07 12.06,18.92 D14.5 | 29.72,20.07 29.34,20.07 | 31.24,20.07 32.38,18.92 D16.5 | 27.81,20.07 26.42,20.07 v25.15,18.8 25.15,17.78 24.89,17.53 24.89,16.22 D15.22 | 17.65,20.07 16.26,20.07 v14.99,18.8 14.99,17.78 14.73,17.53 14.73,16.22 D14.22 | 21.08,20.07 22.23,18.92 D15.5 | 19.56,20.07 19.18,20.07 | 80.52,20.07 80.14,20.07 | 78.61,20.07 77.22,20.07 v75.95,18.8 75.95,17.78 75.69,17.53 75.69,16.26 75.69,16.22 | 68.45,20.07 67.06,20.07 v65.79,18.8 65.79,17.78 65.53,17.53 65.53,16.22 D19.22 | 71.88,20.07 73.03,18.92 D20.5 | 70.36,20.07 69.98,20.07 | 90.68,20.07 90.3,20.07 | 92.2,20.07 93.34,18.92 D22.5 | 88.77,20.07 87.38,20.07 v86.11,18.8 86.11,17.78 85.85,17.53 85.85,16.22 D21.22 | 82.04,20.07 83.19,18.92 D21.5 | 111,20.07 110.62,20.07 | 109.09,20.07 107.7,20.07 v106.43,18.8 106.43,17.78 106.17,17.53 106.17,16.22 D23.22 | 102.36,20.07 103.5,18.92 D23.5 | 100.84,20.07 100.46,20.07 | 50.04,20.07 49.66,20.07 | 48.13,20.07 46.74,20.07 v45.47,18.8 45.47,17.78 45.21,17.53 45.21,16.22 D17.22 | 37.97,20.07 36.58,20.07 v35.31,18.8 35.31,16.51 35.05,16.26 35.05,16 34.95,16.1 | 41.4,20.07 42.55,18.92 D17.5 | 39.88,20.07 39.5,20.07 | 60.2,20.07 59.82,20.07 | 61.72,20.07 62.87,18.92 D19.5 | 58.29,20.07 56.9,20.07 v55.63,18.8 55.63,17.78 55.37,17.53 55.37,16.22 D18.22 | 51.56,20.07 52.7,18.92 D18.5 | 141.48,20.07 141.1,20.07 | 139.57,20.07 138.18,20.07 v136.91,18.8 136.91,17.78 136.65,17.53 136.65,16.22 D26.22 136.53,16.1 v136.53,13.84 | 129.41,20.07 128.02,20.07 v126.75,18.8 126.75,17.78 126.49,17.53 126.49,16.22 D25.22
  Top 0.61: 132.84,20.07 133.99,18.92 D26.5 | 131.32,20.07 130.94,20.07 | v147.07,18.8 147.07,17.78 146.81,17.53 146.81,16.22 D27.22 | 143,20.07 144.15,18.92 D27.5 | 121.16,20.07 120.78,20.07 | 122.68,20.07 123.83,18.92 D25.5 | 119.25,20.07 117.86,20.07 v116.59,18.8 116.59,17.78 116.33,17.53 116.33,16.22 D24.22 | 112.52,20.07 113.67,18.92 D24.5 | 98.93,20.07 97.54,20.07 v96.27,18.8 96.27,17.78 96.01,17.53 96.01,16.22 D22.22 | 34.8,16.26 34.95,16.1 | D16.22 34.95,16.1
  Bottom 0.61: v14.99,18.8 14.86,18.92 D14.5 | v4.95,18.92 D2.5 | v25.15,18.8 25.02,18.92 D15.5 | v35.31,18.8 35.18,18.92 D16.5 | v45.47,18.8 45.34,18.92 D17.5 | v55.63,18.8 55.5,18.92 D18.5 | v65.79,18.8 65.66,18.92 D19.5 | v75.95,18.8 75.82,18.92 D20.5 | v86.11,18.8 85.98,18.92 D21.5 | v96.27,18.8 96.14,18.92 D22.5 | v106.43,18.8 106.3,18.92 D23.5 | v116.59,18.8 116.46,18.92 D24.5 | v126.75,18.8 126.62,18.92 D25.5 | v136.91,18.8 136.78,18.92 D26.5 | v147.07,18.8 146.94,18.92 D27.5 | M7.3 135.51,13.84 v136.53,13.84
SEG_DP
  Top 0.406: 18.67,22.35 18.8,22.35 19.94,23.5 20.19,23.5 D14.8 | 28.83,22.35 28.96,22.35 30.1,23.5 30.35,23.5 D15.8 | 130.43,22.35 130.56,22.35 131.7,23.5 131.95,23.5 D25.8 | 140.59,22.35 140.72,22.35 141.86,23.5 142.11,23.5 D26.8 | 110.11,22.35 110.24,22.35 111.38,23.5 111.63,23.5 D23.8 | 89.79,22.35 89.92,22.35 91.06,23.5 91.31,23.5 D21.8 | 69.47,22.35 69.6,22.35 70.74,23.5 70.99,23.5 D19.8 | 79.63,22.35 79.76,22.35 80.9,23.5 81.15,23.5 D20.8 | 38.99,22.35 39.12,22.35 40.39,23.62 D16.8 | 49.15,22.35 49.28,22.35 50.42,23.5 50.67,23.5 D17.8 | 59.31,22.35 59.44,22.35 60.58,23.5 60.83,23.5 D18.8 | 120.27,22.35 120.4,22.35 121.54,23.5 121.79,23.5 D24.8 | 99.95,22.35 100.08,22.35 101.35,23.62 D22.8 | 152.53,23.5 D27.8
  Top 0.61: 20.07,23.62 D14.8 21.08,23.62 22.35,22.35 28.83,22.35 | D2.8 10.92,23.62 12.19,22.35 18.67,22.35 | 20.32,16.17 D14.25 | 30.23,23.62 D15.8 31.24,23.62 32.51,22.35 38.99,22.35 | 30.48,16.17 D15.25 | 152.53,23.5 151.38,22.35 144.27,22.35 143,23.62 D26.8 | 132.08,16.17 D25.25 | 130.43,22.35 123.95,22.35 122.68,23.62 D24.8 | 140.59,22.35 134.11,22.35 132.84,23.62 D25.8 | 142.24,16.17 D26.25 | 101.6,16.17 D22.25 | 110.11,22.35 103.63,22.35 102.36,23.62 D22.8 | 111.76,16.17 D23.25 | 89.79,22.35 83.31,22.35 82.04,23.62 D20.8 | 91.44,16.17 D21.25 | 71.12,16.17 D19.25 | 69.47,22.35 62.99,22.35 61.72,23.62 D18.8 | 79.63,22.35 73.15,22.35 71.88,23.62 D19.8 | 81.28,16.17 D20.25 | 40.64,16.17 D16.25 | 49.15,22.35 42.67,22.35 41.4,23.62 D16.8 | 50.8,16.17 D17.25 | D17.8 51.56,23.62 52.83,22.35 59.31,22.35 | D21.8 92.2,23.62 93.47,22.35 99.95,22.35 | D23.8 112.52,23.62 113.79,22.35 120.27,22.35 | 60.96,16.17 D18.25 | 121.92,16.17 D24.25
  Top 0.813: 20.32,16.17 D14.6 20.27,18.87 D14.25 | D2.25 10.11,18.87 D2.6 | 30.48,16.17 D15.6 30.43,18.87 D15.25 | 152.4,16.17 D27.6 152.35,18.87 D27.25 | 132.08,16.17 D25.6 132.03,18.87 D25.25 | 142.24,16.17 D26.6 142.19,18.87 D26.25 | 101.6,16.17 D22.6 101.55,18.87 D22.25 101.55,14.53 JP9.1 | 111.76,16.17 D23.6 111.71,18.87 D23.25 | 91.44,16.17 D21.6 91.39,18.87 D21.25 | 71.12,16.17 D19.6 71.07,18.87 D19.25 | 81.28,16.17 D20.6 81.23,18.87 D20.25 | 40.64,16.17 D16.6 40.59,18.87 D16.25 | 50.8,16.17 D17.6 50.75,18.87 D17.25 50.8,16.07 | 60.96,16.17 D18.6 60.91,18.87 D18.25 60.71,15.92 60.71,13.97 59.94,13.21 JP12.1 | 121.92,16.17 D24.6 121.87,18.87 D24.25
  Bottom 0.61: 10.16,23.37 8.89,22.1 8.89,20.32 9.91,19.3 | 152.4,23.37 151.13,22.1 151.13,20.32 152.15,19.3 | 142.24,23.37 140.97,22.1 140.97,20.32 141.99,19.3 | 132.08,23.37 130.81,22.1 130.81,20.32 131.83,19.3 | 121.92,23.37 120.65,22.1 120.65,20.32 121.67,19.3 | 111.76,23.37 110.49,22.1 110.49,20.32 111.51,19.3 | 101.6,23.37 100.33,22.1 100.33,20.32 101.35,19.3 | D21.8 90.17,22.35 90.17,20.32 91.19,19.3 | 81.28,23.37 80.01,22.1 80.01,20.32 81.03,19.3 | 71.12,23.37 69.85,22.1 69.85,20.32 70.87,19.3 | 60.96,23.37 59.69,22.1 59.69,20.32 60.71,19.3 | 50.8,23.37 49.53,22.1 49.53,20.32 50.55,19.3 | 40.64,23.37 39.37,22.1 39.37,20.32 40.39,19.3 | 30.48,23.37 29.21,22.1 29.21,20.32 30.23,19.3 | 20.32,23.37 19.05,22.1 19.05,20.32 20.07,19.3
  Bottom 0.813: D2.8 10.16,23.37 | 9.91,19.3 9.91,19.18 D2.6 | D14.8 20.32,23.37 | D27.8 152.4,23.37 | 152.15,19.3 152.15,19.18 D27.6 | D26.8 142.24,23.37 | 141.99,19.3 141.99,19.18 D26.6 | D25.8 132.08,23.37 | 131.83,19.3 131.83,19.18 D25.6 | D24.8 121.92,23.37 | 121.67,19.3 121.67,19.18 D24.6 | D23.8 111.76,23.37 | 111.51,19.3 111.51,19.18 D23.6 | D22.8 101.6,23.37 | 101.35,19.3 101.35,19.18 D22.6 | 91.19,19.3 91.19,19.18 D21.6 | D20.8 81.28,23.37 | 81.03,19.3 81.03,19.18 D20.6 | D19.8 71.12,23.37 | 70.87,19.3 70.87,19.18 D19.6 | D18.8 60.96,23.37 | 60.71,19.3 60.71,19.18 D18.6 | D17.8 50.8,23.37 | 50.55,19.3 50.55,19.18 D17.6 | D16.8 40.64,23.37 | 40.39,19.3 40.39,19.18 D16.6 | D15.8 30.48,23.37 | 30.23,19.3 30.23,19.18 D15.6 | 20.07,19.3 20.07,19.18 D14.6
SEG_DP_SOURCE
  Bottom 0.406: 63.63,11.18 63.63,11.3 60.71,14.22
  Bottom 0.61: M11.3 72.39,9.53 72.01,9.14 67.31,9.14 66.55,9.91 66.17,9.91 65.41,10.67 64.14,10.67 63.63,11.18 | 60.71,14.22 59.05,14.22 JP7.1
SEG_E  (via drill 0.51)
  Top 0.406: 3.81,18.41 2.54,17.14 | 21.08,22.35 19.81,22.35 19.05,21.59 13.21,21.59 D14.4 | 10.92,22.35 9.4,22.35 | 61.72,22.35 60.45,22.35 59.69,21.59 53.85,21.59 D18.4 | 51.56,22.35 50.29,22.35 49.53,21.59 43.69,21.59 D17.4 | 41.4,22.35 40.13,22.35 39.37,21.59 33.53,21.59 D16.4 | 31.24,22.35 29.97,22.35 29.21,21.59 23.37,21.59 D15.4 | 71.88,22.35 70.61,22.35 69.85,21.59 64.01,21.59 D19.4 | 102.36,22.35 101.09,22.35 100.33,21.59 94.49,21.59 D22.4 | 143,22.35 141.73,22.35 140.97,21.59 135.13,21.59 D26.4 | 132.84,22.35 131.57,22.35 130.81,21.59 124.97,21.59 D25.4 | 112.52,22.35 111.25,22.35 110.49,21.59 104.65,21.59 D23.4 | D24.4 114.81,21.59 120.65,21.59 121.41,22.35 122.68,22.35 | 82.04,22.35 80.77,22.35 80.01,21.59 74.17,21.59 D20.4 | 92.2,22.35 90.93,22.35 90.17,21.59 84.33,21.59 D21.4 | 83.82,17.14 83.82,16.17 D21.21 | 114.3,16.17 D24.21 | 12.7,16.17 D14.21 | D16.21 33.07,16.46 33.02,16.51 | 73.66,16.51 73.66,16.17 D20.21 | D15.21 22.91,16.05 22.86,16 | 63.5,17.14 63.5,16.17 D19.21
  Top 0.61: 2.79,21.08 3.81,20.07 | 3.81,20.07 3.81,18.41 | 2.54,17.14 2.54,16.17 D2.21 | 12.7,16.17 12.7,17.14 13.97,18.41 13.97,19.81 D14.4 | 21.08,22.35 22.35,21.08 D15.4 24.13,19.81 24.13,18.41 22.86,17.14 22.86,16.17 | 12.95,21.34 D14.4 | 2.79,21.34 D2.4 | 10.92,22.35 12.19,21.08 D14.4 | 9.4,22.35 8.64,21.59 5.33,21.59 3.81,20.07 | 33.02,16.17 33.02,16.51 33.02,17.14 34.29,18.41 34.29,19.81 D16.4 | 41.4,22.35 42.67,21.08 D17.4 44.45,19.81 44.45,18.41 43.18,17.14 43.18,16.17 D17.21 | 33.27,21.34 D16.4 | D16.4 32.51,21.08 31.24,22.35 | 51.56,22.35 52.83,21.08 D18.4 54.61,19.81 54.61,18.41 53.34,17.14 53.34,16.17 D18.21 | 71.88,22.35 73.15,21.08 D20.4 74.93,19.81 74.93,18.41 73.66,17.14 73.66,16.51 | 63.75,21.34 D19.4 | 61.72,22.35 62.99,21.08 D19.4 | D19.4 64.77,19.81 64.77,18.41 63.5,17.14 | 102.36,22.35 103.63,21.08 D23.4 105.41,19.81 105.41,18.41 104.14,17.14 104.14,16.17 D23.21 | 94.23,21.34 D22.4 | D22.4 93.47,21.08 92.2,22.35 | D22.4 95.25,19.81 95.25,18.41 93.98,17.14 93.98,16.17 D22.21 | 143,22.35 144.27,21.08 D27.4 146.05,19.81 146.05,18.41 144.78,17.14 144.78,16.17 D27.21 | 132.84,22.35 134.11,21.08 D26.4 135.89,19.81 135.89,18.41 134.62,17.14 134.62,16.26 | 124.71,21.34 D25.4 | D25.4 123.95,21.08 122.68,22.35 | D25.4 125.73,19.81 125.73,18.41 124.46,17.14 124.46,16.17 D25.21 | 134.62,16.26 134.62,16.17 | 112.52,22.35 113.79,21.08 D24.4 115.57,19.81 115.57,18.41 114.3,17.14 114.3,16.17 | 83.82,17.14 85.09,18.41 85.09,19.81 D21.4 83.31,21.08 82.04,22.35 | D26.21 134.67,16.21 134.62,16.26
  Top 0.813: D2.4 2.79,21.08 | 22.86,16.17 22.86,16 v22.86,13.84
  Bottom 0.254: 19.96,13.11 19.94,13.11
  Bottom 0.61: 19.96,13.11 20.95,14.1 22.61,14.1 v22.86,13.84 | 19.94,13.11 19.94,12.19 M8.3
SEG_F  (via drill 0.51)
  Top 0.305: 24.89,30.61 24.89,31.02 D15.29
  Top 0.406: 97.28,28.7 v97.28,27.43
  Top 0.61: v5.84,27.43 5.84,28.7 4.57,29.97 4.57,31.02 D2.29 | 9.14,24.89 11.43,24.89 D14.2 | v16,27.43 16,28.7 14.73,29.97 | 21.59,24.89 16.38,24.89 v16.26,24.77 16.13,24.89 13.97,24.89 13.72,25.15 | v26.16,27.43 26.16,28.7 24.89,29.97 | 31.75,24.89 26.54,24.89 v26.42,24.77 26.29,24.89 24.13,24.89 23.88,25.15 | v127.76,27.43 127.76,28.7 126.49,29.97 126.49,31.02 D25.29 | 133.35,24.89 128.14,24.89 v128.02,24.77 127.89,24.89 125.73,24.89 125.48,25.15 | v137.92,27.43 137.92,28.7 136.65,29.97 136.65,31.02 D26.29 | 143.51,24.89 138.3,24.89 v138.18,24.77 138.05,24.89 135.89,24.89 135.64,25.15 | 145.8,25.15 146.05,24.89 148.21,24.89 v148.34,24.77 148.46,24.89 | v36.32,27.43 36.32,28.7 35.05,29.97 | 41.91,24.89 36.7,24.89 v36.58,24.77 36.45,24.89 34.29,24.89 34.04,25.15 | v46.48,27.43 46.48,28.7 45.21,29.97 | 44.2,25.15 44.45,24.89 46.61,24.89 v46.74,24.77 46.86,24.89 52.07,24.89 | v56.64,27.43 56.64,28.7 55.37,29.97 | 62.23,24.89 57.02,24.89 v56.9,24.77 56.77,24.89 54.61,24.89 54.36,25.15 | v66.8,27.43 66.8,28.7 65.53,29.97 | 72.39,24.89 67.18,24.89 v67.06,24.77 66.93,24.89 64.77,24.89 64.52,25.15 | v148.08,27.43 148.08,28.7 146.81,29.97 146.81,31.02 D27.29 | 97.28,28.7 96.01,29.97 | 102.87,24.89 97.66,24.89 v97.54,24.77 97.41,24.89 95.25,24.89 95,25.15 | v107.44,27.43 107.44,28.7 106.17,29.97 | 113.03,24.89 107.82,24.89 v107.7,24.77 107.57,24.89 105.41,24.89 105.16,25.15 | v117.6,27.43 117.6,28.7 116.33,29.97 | 123.19,24.89 117.98,24.89 v117.86,24.77 117.73,24.89 115.57,24.89 115.32,25.15 | v76.96,27.69 76.96,28.7 75.69,29.97 | 74.68,25.15 74.8,25.02 v76.83,25.02 76.96,24.89 82.68,24.89 83.82,26.04 D21.2
  Top 0.61: 65.53,30.61 65.53,31.02 D19.29 | 75.69,30.61 75.69,31.02 D20.29 | 85.85,30.61 85.85,31.02 D21.29 | v87.12,27.43 87.12,28.7 85.85,29.97 | 84.84,25.15 85.09,24.89 87.25,24.89 v87.38,24.77 87.5,24.89 92.71,24.89 | 106.17,30.61 106.17,31.02 D23.29 | D24.29 116.23,30.71 116.33,30.61 | v16.76,12.7 16.76,12.95 19.18,12.95 19.81,12.32 19.81,8.76 20.32,8.26 27.69,8.26 v28.45,9.02
  Top 0.813: 9.14,24.89 8.89,25.15 v6.1,25.15 3.56,25.15 D2.2 | 21.59,24.89 D15.2 23.88,25.15 | 13.72,25.15 D14.2 | D14.29 14.63,30.71 14.73,30.61 14.73,29.97 | 62.23,24.89 D19.2 64.52,25.15 | D16.29 34.95,30.71 35.05,30.61 35.05,29.97 | 24.89,30.61 24.89,29.97 | 41.91,24.89 D17.2 44.2,25.15 | 31.75,24.89 D16.2 34.04,25.15 | 52.07,24.89 D18.2 54.36,25.15 | 113.03,24.89 D24.2 115.32,25.15 | 143.51,24.89 D27.2 145.8,25.15 | 133.35,24.89 D26.2 135.64,25.15 | 72.39,24.89 D20.2 74.68,25.15 | 45.21,29.97 45.21,31.02 D17.29 | 55.37,29.97 55.37,31.02 D18.29 | 65.53,30.61 65.53,29.97 | 125.48,25.15 D25.2 123.19,24.89 | 96.01,29.97 96.01,31.02 D22.29 | 105.16,25.15 D23.2 102.87,24.89 | 106.17,30.61 106.17,29.97 | 116.33,30.61 116.33,29.97 | 75.69,30.61 75.69,29.97 | 84.84,25.15 D21.2 | 85.85,30.61 85.85,29.97 | 92.71,24.89 D22.2 95,25.15
  Bottom 0.61: v5.84,27.43 5.84,25.4 v6.1,25.15 | 16,25.15 v16.26,24.77 | v16,27.43 16,25.15 | 16,25.15 16,25.02 v16.26,24.77 | 26.16,25.15 v26.42,24.77 26.16,25.02 v26.16,27.43 | 36.32,25.15 v36.58,24.77 36.32,25.02 v36.32,27.43 | 66.8,25.15 v67.06,24.77 66.8,25.02 v66.8,27.43 | 56.64,25.15 v56.9,24.77 56.64,25.02 v56.64,27.43 | 46.48,25.15 v46.74,24.77 46.48,25.02 v46.48,27.43 | 87.12,25.15 v87.38,24.77 87.12,25.02 v87.12,27.43 | 97.28,25.15 v97.54,24.77 97.28,25.02 v97.28,27.43 | 107.44,25.15 v107.7,24.77 107.44,25.02 v107.44,27.43 | 117.6,25.15 v117.86,24.77 117.6,25.02 v117.6,27.43 | 127.76,25.15 v128.02,24.77 127.76,25.02 v127.76,27.43 | 137.92,25.15 v138.18,24.77 137.92,25.02 v137.92,27.43 | 148.08,25.15 v148.34,24.77 148.08,25.02 v148.08,27.43 | v16.26,24.77 16.13,24.64 16.13,13.34 v16.76,12.7 | M9.3 31.62,8.26 31.37,8.51 28.96,8.51 v28.45,9.02 | v76.96,27.69 76.96,27.56 76.83,27.43 v76.83,25.02
SEG_G
  Top 0.305: 9.4,27.18 10.92,27.3 | 19.56,27.18 21.08,27.3 | 13.59,27.81 14.22,27.18 | D15.30 22.91,31.04 22.86,30.99 | D14.30 12.75,31.04 12.7,30.99 | 29.72,27.18 31.24,27.3 | 23.75,27.81 24.38,27.18 | 131.32,27.18 132.84,27.3 | 135.51,27.81 136.14,27.18 | 39.88,27.18 41.4,27.3 | 44.07,27.81 44.7,27.18 | 33.91,27.81 34.54,27.18 | 50.04,27.18 51.56,27.3 | 60.2,27.18 61.72,27.3 | 54.23,27.81 54.86,27.18 | 70.36,27.18 71.88,27.3 | 64.39,27.81 65.02,27.18 | 80.52,27.18 82.04,27.3 | 74.55,27.81 75.18,27.18 | 84.71,27.81 85.34,27.18 | 100.84,27.18 102.36,27.3 | 111,27.18 112.52,27.3 | 105.03,27.81 105.66,27.18 | 121.16,27.18 122.68,27.3 | 115.19,27.81 115.82,27.18 | 125.35,27.81 125.98,27.18 | 141.48,27.18 143,27.3 | 90.68,27.18 92.2,27.3 | 94.87,27.81 95.5,27.18
  Top 0.406: 17.27,27.18 16.51,26.42 14.99,26.42 14.22,27.18 | D14.1 13.08,28.32 13.59,27.81 | 27.43,27.18 26.67,26.42 25.15,26.42 24.38,27.18 | D15.1 23.24,28.32 23.75,27.81 | 129.03,27.18 128.27,26.42 126.75,26.42 125.98,27.18 | 139.19,27.18 138.43,26.42 136.91,26.42 136.14,27.18 | D26.1 135,28.32 135.51,27.81 | 37.59,27.18 36.83,26.42 35.31,26.42 34.54,27.18 | D16.1 33.4,28.32 33.91,27.81 | 47.75,27.18 46.99,26.42 45.47,26.42 44.7,27.18 | D17.1 43.56,28.32 44.07,27.81 | 57.91,27.18 57.15,26.42 55.63,26.42 54.86,27.18 | D18.1 53.72,28.32 54.23,27.81 | 68.07,27.18 67.31,26.42 65.79,26.42 65.02,27.18 | D19.1 63.88,28.32 64.39,27.81 | 78.23,27.18 77.72,26.67 75.69,26.67 75.18,27.18 | D20.1 74.04,28.32 74.55,27.81 | 88.39,27.18 87.63,26.42 86.11,26.42 85.34,27.18 | D21.1 84.2,28.32 84.71,27.81 | 98.55,27.18 97.79,26.42 96.27,26.42 95.5,27.18 | 108.71,27.18 107.95,26.42 106.43,26.42 105.66,27.18 | D23.1 104.52,28.32 105.03,27.81 | 118.87,27.18 118.11,26.42 116.59,26.42 115.82,27.18 | D24.1 114.68,28.32 115.19,27.81 | D25.1 124.84,28.32 125.35,27.81 | 145.16,28.32 D27.1 | D22.1 94.36,28.32 94.87,27.81 | 114.3,31.07 D24.30
  Top 0.61: 9.4,27.18 7.24,27.18 6.48,26.42 4.19,26.42 2.54,28.07 D2.1 | 10.92,27.3 11.94,28.32 D14.1 | 19.56,27.18 17.27,27.18 | 21.08,27.3 22.1,28.32 D15.1 | 29.72,27.18 27.43,27.18 | 131.32,27.18 129.03,27.18 | 132.84,27.3 133.86,28.32 D26.1 | 141.48,27.18 139.19,27.18 | 31.24,27.3 32.26,28.32 D16.1 | 39.88,27.18 37.59,27.18 | 41.4,27.3 42.42,28.32 D17.1 | 50.04,27.18 47.75,27.18 | 51.56,27.3 52.58,28.32 D18.1 | 60.2,27.18 57.91,27.18 | 61.72,27.3 62.74,28.32 D19.1 | 70.36,27.18 68.07,27.18 | 71.88,27.3 72.9,28.32 D20.1 | 80.52,27.18 78.23,27.18 | 82.04,27.3 83.06,28.32 D21.1 | 100.84,27.18 98.55,27.18 | 102.36,27.3 103.38,28.32 D23.1 | 111,27.18 108.71,27.18 | 112.52,27.3 113.54,28.32 D24.1 | 121.16,27.18 118.87,27.18 | D25.1 123.7,28.32 122.68,27.3 | D27.1 144.02,28.32 143,27.3 | 63.5,30.99 63.5,31.07 D19.30 | 83.82,31.07 D21.30 | 90.68,27.18 88.39,27.18 | 92.2,27.3 93.22,28.32 D22.1 | 134.62,30.99 134.62,31.07 D26.30 | 144.78,31.07 D27.30 | D25.30 124.46,31.07 | 104.14,30.99 104.14,31.07 D23.30 | D22.30 94.03,31.04 93.98,30.99 | D20.30 73.66,31.07 | D18.30 53.39,31.04 53.34,30.99 | 43.18,31.07 D17.30 | D16.30 33.02,31.07
  Top 0.813: D2.1 2.54,31.07 D2.30 | 12.32,28.32 D14.1 12.7,30.99 12.7,31.07 | D16.1 33.02,31.07 | 33.15,28.07 33.02,28.07 D16.1 | 22.86,31.07 22.86,30.99 D15.1 | 22.99,28.07 22.86,28.07 D15.1 | D15.1 22.48,28.32 | D25.1 124.46,30.99 | D27.1 144.78,31.07 | 144.91,28.07 144.78,28.07 D27.1 | 134.75,28.07 134.62,28.07 D26.1 | D26.1 134.24,28.32 | D26.1 134.62,30.99 | D16.1 32.64,28.32 | D16.1 33.02,30.99 | D17.1 43.18,31.07 | 43.31,28.07 43.18,28.07 D17.1 | D17.1 42.8,28.32 | 53.34,31.07 53.34,30.99 D18.1 | 53.47,28.07 53.34,28.07 D18.1 | D18.1 52.96,28.32 | D20.1 73.66,31.07 | 73.79,28.07 73.66,28.07 D20.1 | 63.63,28.07 63.5,28.07 D19.1 | D19.1 63.12,28.32 | D19.1 63.5,30.99 | D20.1 73.28,28.32 | D20.1 73.66,30.99 | D21.1 83.82,31.07 | 83.95,28.07 83.82,28.07 D21.1 | D21.1 83.44,28.32 | 114.43,28.07 114.3,28.07 D24.1 | 104.27,28.07 104.14,28.07 D23.1 | D23.1 103.76,28.32 | D23.1 104.14,30.99 | D24.1 113.92,28.32 | D24.1 114.3,31.07 | D25.1 124.46,31.07 | 124.59,28.07 124.46,28.07 D25.1 | D25.1 124.08,28.32 | D27.1 144.4,28.32 | D27.1 144.78,30.99 | D22.1 93.98,30.99 93.98,31.07 | 94.11,28.07 93.98,28.07 D22.1 | D22.1 93.6,28.32
  Bottom 0.406: 76.2,17.4 76.96,18.16 76.96,20.83 76.33,21.46
  Bottom 0.61: D2.3 2.54,24.38 3.81,25.65 3.81,27.05 D2.1 | D14.3 12.7,24.38 13.97,25.65 13.97,27.05 D14.1 | D16.3 33.02,24.38 34.29,25.65 34.29,27.05 D16.1 | D17.3 43.18,24.38 44.45,25.65 44.45,27.05 D17.1 | D18.3 53.34,24.38 54.61,25.65 54.61,27.05 D18.1 | D19.3 63.5,24.38 64.77,25.65 64.77,27.05 D19.1 | D20.1 74.93,27.05 74.93,25.65 73.66,24.38 D20.3 75.82,21.46 76.33,21.46 | D21.3 83.82,24.38 85.09,25.65 85.09,27.05 D21.1 | D22.3 93.98,24.38 95.25,25.65 95.25,27.05 D22.1 | D23.3 104.14,24.38 105.41,25.65 105.41,27.05 D23.1 | D24.3 114.3,24.38 115.57,25.65 115.57,27.05 D24.1 | D25.3 124.46,24.38 125.73,25.65 125.73,27.05 D25.1 | D26.3 134.62,24.38 135.89,25.65 135.89,27.05 D26.1 | D27.3 144.78,24.38 146.05,25.65 146.05,27.05 D27.1 | D15.1 24.13,27.05 24.13,25.65 22.86,24.38 D15.3 | 66.78,11.33 M10.3 67.69,10.41 69.22,10.41 76.2,17.4

## Text on the board
bPlace: /profiles/Jens_G | /profiles/Jens_G | https:/ /oshpark.com | CERN OHL v.1.2 | source | open